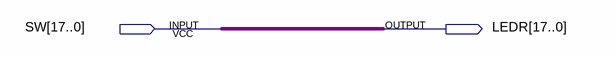
[diagram p0: schematic sheet]
// Quartus schematic SWtoLED.bdf as structural Verilog: 0 symbols, 2 pins
module SWtoLED (
  input  [17:0] SW,
  output [17:0] LEDR
);


  assign LEDR = SW;
endmodule
